# Altium schematic sheet 07_ZYNQ_DDR.SchDoc
size A3; SheetNumber: 7; SheetTotal: 9
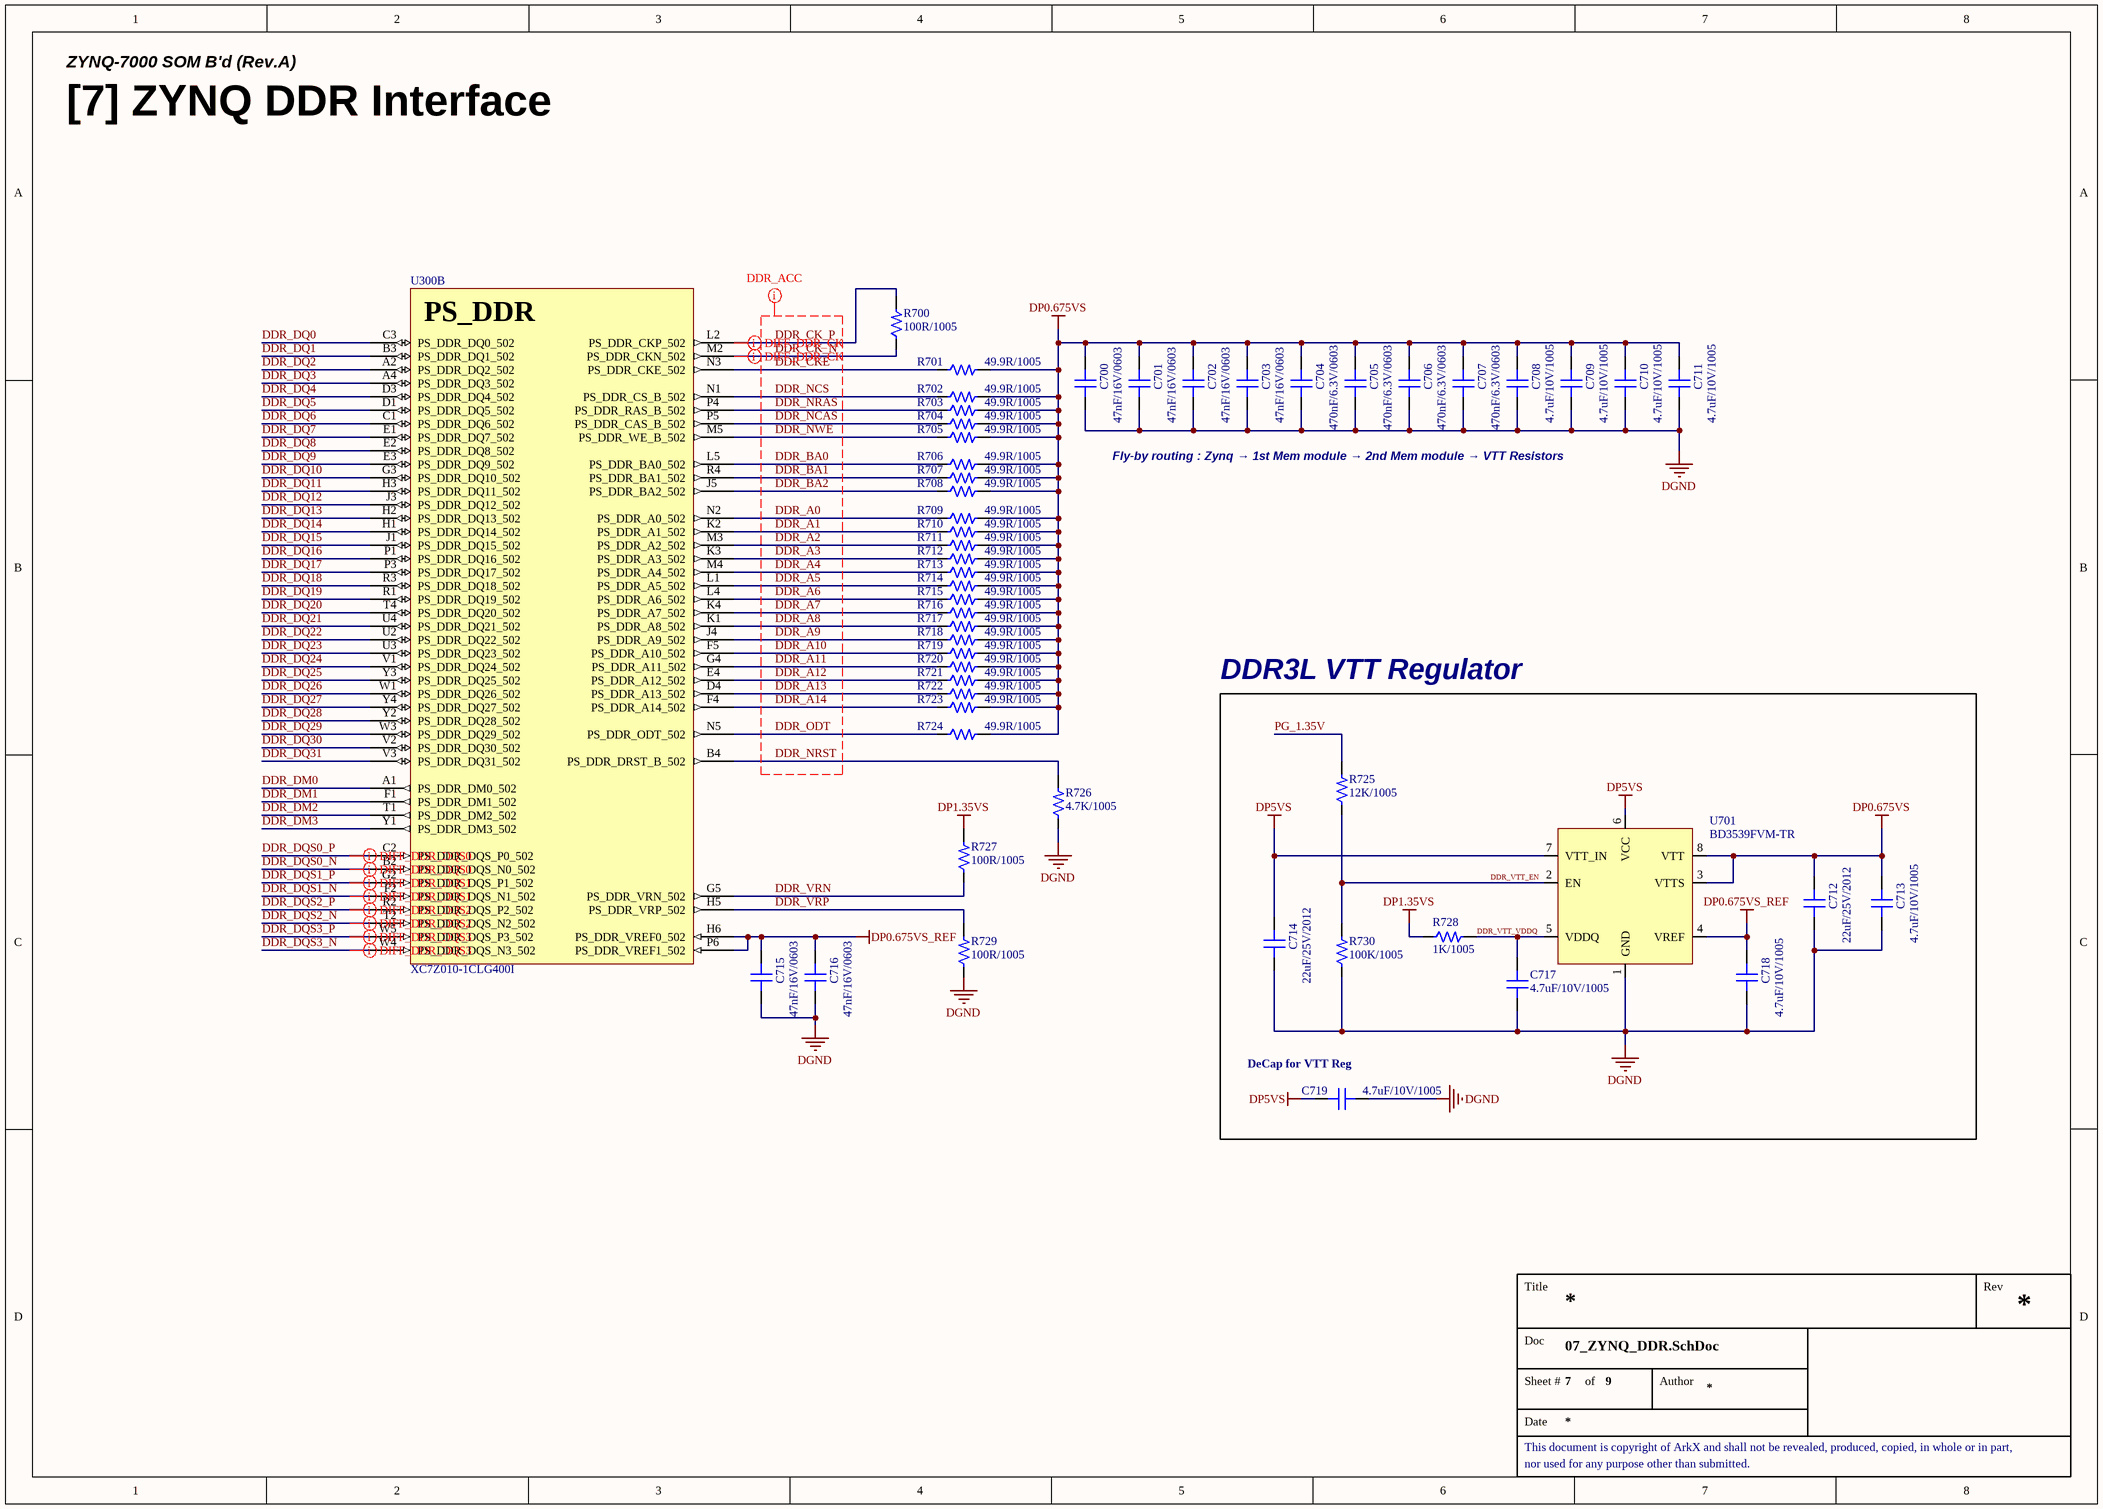
[diagram p0: 07_ZYNQ_DDR.SchDoc]

## Parts
C700  47nF/16V/0603  [CAP 0603 (0201_INCH)]
C701  47nF/16V/0603  [CAP 0603 (0201_INCH)]
C702  47nF/16V/0603  [CAP 0603 (0201_INCH)]
C703  47nF/16V/0603  [CAP 0603 (0201_INCH)]
C704  470nF/6.3V/0603  [CAP 0603 (0201_INCH)]
C705  470nF/6.3V/0603  [CAP 0603 (0201_INCH)]
C706  470nF/6.3V/0603  [CAP 0603 (0201_INCH)]
C707  470nF/6.3V/0603  [CAP 0603 (0201_INCH)]
C708  4.7uF/10V/1005  [CAP 1005 (0402_INCH)]
C709  4.7uF/10V/1005  [CAP 1005 (0402_INCH)]
C710  4.7uF/10V/1005  [CAP 1005 (0402_INCH)]
C711  4.7uF/10V/1005  [CAP 1005 (0402_INCH)]
C712  22uF/25V/2012  [CAP 2012 (0805_INCH)]
C713  4.7uF/10V/1005  [CAP 1005 (0402_INCH)]
C714  22uF/25V/2012  [CAP 2012 (0805_INCH)]
C715  47nF/16V/0603  [CAP 0603 (0201_INCH)]
C716  47nF/16V/0603  [CAP 0603 (0201_INCH)]
C717  4.7uF/10V/1005  [CAP 1005 (0402_INCH)]
C718  4.7uF/10V/1005  [CAP 1005 (0402_INCH)]
C719  4.7uF/10V/1005  [CAP 1005 (0402_INCH)]
R700  100R/1005  [RES 1005 (0402_inch)]
R701  49.9R/1005  [RES 1005 (0402_inch)]
R702  49.9R/1005  [RES 1005 (0402_inch)]
R703  49.9R/1005  [RES 1005 (0402_inch)]
R704  49.9R/1005  [RES 1005 (0402_inch)]
R705  49.9R/1005  [RES 1005 (0402_inch)]
R706  49.9R/1005  [RES 1005 (0402_inch)]
R707  49.9R/1005  [RES 1005 (0402_inch)]
R708  49.9R/1005  [RES 1005 (0402_inch)]
R709  49.9R/1005  [RES 1005 (0402_inch)]
R710  49.9R/1005  [RES 1005 (0402_inch)]
R711  49.9R/1005  [RES 1005 (0402_inch)]
R712  49.9R/1005  [RES 1005 (0402_inch)]
R713  49.9R/1005  [RES 1005 (0402_inch)]
R714  49.9R/1005  [RES 1005 (0402_inch)]
R715  49.9R/1005  [RES 1005 (0402_inch)]
R716  49.9R/1005  [RES 1005 (0402_inch)]
R717  49.9R/1005  [RES 1005 (0402_inch)]
R718  49.9R/1005  [RES 1005 (0402_inch)]
R719  49.9R/1005  [RES 1005 (0402_inch)]
R720  49.9R/1005  [RES 1005 (0402_inch)]
R721  49.9R/1005  [RES 1005 (0402_inch)]
R722  49.9R/1005  [RES 1005 (0402_inch)]
R723  49.9R/1005  [RES 1005 (0402_inch)]
R724  49.9R/1005  [RES 1005 (0402_inch)]
R725  12K/1005  [RES 1005 (0402_inch)]
R726  4.7K/1005  [RES 1005 (0402_inch)]
R727  100R/1005  [RES 1005 (0402_inch)]
R728  1K/1005  [RES 1005 (0402_inch)]
R729  100R/1005  [RES 1005 (0402_inch)]
R730  100K/1005  [RES 1005 (0402_inch)]
U300  XC7Z010-1CLG400I  [IC_SOC_XC7Z010-1CLG400I]  (part B of 9)
U701  BD3539FVM-TR  [IC_MSOP-8]

## Blocks framed on the sheet
DDR3L VTT Regulator: C712-C714 C717-C719 R725 R728 R730 U701

## Nets
DGND: C700.1 C701.1 C702.1 C703.1 C704.1 C705.1 C706.1 C707.1 C708.1 C709.1 C710.1 C711.1 C712.1 C713.1 C714.1 C715.1 C716.1 C717.1 C718.1 C719.2 R726.1 R729.1 R730.1 U701.1(GND)
DP0.675VS: C700.2 C701.2 C702.2 C703.2 C704.2 C705.2 C706.2 C707.2 C708.2 C709.2 C710.2 C711.2 C712.2 C713.2 R701.2 R702.2 R703.2 R704.2 R705.2 R706.2 R707.2 R708.2 R709.2 R710.2 R711.2 R712.2 R713.2 R714.2 R715.2 R716.2 R717.2 R718.2 R719.2 R720.2 R721.2 R722.2 R723.2 R724.2 U701.3(VTTS) U701.8(VTT)
DP0.675VS_REF: C715.2 C716.2 C718.2 U300.H6(PS_DDR_VREF0_502) U300.P6(PS_DDR_VREF1_502) U701.4(VREF)
DP1.35VS: R727.2 R728.1
DP5VS: C714.2 C719.1 U701.6(VCC) U701.7(VTT_IN)
DDR_A0: R709.1 U300.N2(PS_DDR_A0_502)
DDR_A1: R710.1 U300.K2(PS_DDR_A1_502)
DDR_A2: R711.1 U300.M3(PS_DDR_A2_502)
DDR_A3: R712.1 U300.K3(PS_DDR_A3_502)
DDR_A4: R713.1 U300.M4(PS_DDR_A4_502)
DDR_A5: R714.1 U300.L1(PS_DDR_A5_502)
DDR_A6: R715.1 U300.L4(PS_DDR_A6_502)
DDR_A7: R716.1 U300.K4(PS_DDR_A7_502)
DDR_A8: R717.1 U300.K1(PS_DDR_A8_502)
DDR_A9: R718.1 U300.J4(PS_DDR_A9_502)
DDR_A10: R719.1 U300.F5(PS_DDR_A10_502)
DDR_A11: R720.1 U300.G4(PS_DDR_A11_502)
DDR_A12: R721.1 U300.E4(PS_DDR_A12_502)
DDR_A13: R722.1 U300.D4(PS_DDR_A13_502)
DDR_A14: R723.1 U300.F4(PS_DDR_A14_502)
DDR_BA0: R706.1 U300.L5(PS_DDR_BA0_502)
DDR_BA1: R707.1 U300.R4(PS_DDR_BA1_502)
DDR_BA2: R708.1 U300.J5(PS_DDR_BA2_502)
DDR_CK_N: R700.1 U300.M2(PS_DDR_CKN_502)
DDR_CK_P: R700.2 U300.L2(PS_DDR_CKP_502)
DDR_CKE: R701.1 U300.N3(PS_DDR_CKE_502)
DDR_DM0: U300.A1(PS_DDR_DM0_502)
DDR_DM1: U300.F1(PS_DDR_DM1_502)
DDR_DM2: U300.T1(PS_DDR_DM2_502)
DDR_DM3: U300.Y1(PS_DDR_DM3_502)
DDR_DQ0: U300.C3(PS_DDR_DQ0_502)
DDR_DQ1: U300.B3(PS_DDR_DQ1_502)
DDR_DQ2: U300.A2(PS_DDR_DQ2_502)
DDR_DQ3: U300.A4(PS_DDR_DQ3_502)
DDR_DQ4: U300.D3(PS_DDR_DQ4_502)
DDR_DQ5: U300.D1(PS_DDR_DQ5_502)
DDR_DQ6: U300.C1(PS_DDR_DQ6_502)
DDR_DQ7: U300.E1(PS_DDR_DQ7_502)
DDR_DQ8: U300.E2(PS_DDR_DQ8_502)
DDR_DQ9: U300.E3(PS_DDR_DQ9_502)
DDR_DQ10: U300.G3(PS_DDR_DQ10_502)
DDR_DQ11: U300.H3(PS_DDR_DQ11_502)
DDR_DQ12: U300.J3(PS_DDR_DQ12_502)
DDR_DQ13: U300.H2(PS_DDR_DQ13_502)
DDR_DQ14: U300.H1(PS_DDR_DQ14_502)
DDR_DQ15: U300.J1(PS_DDR_DQ15_502)
DDR_DQ16: U300.P1(PS_DDR_DQ16_502)
DDR_DQ17: U300.P3(PS_DDR_DQ17_502)
DDR_DQ18: U300.R3(PS_DDR_DQ18_502)
DDR_DQ19: U300.R1(PS_DDR_DQ19_502)
DDR_DQ20: U300.T4(PS_DDR_DQ20_502)
DDR_DQ21: U300.U4(PS_DDR_DQ21_502)
DDR_DQ22: U300.U2(PS_DDR_DQ22_502)
DDR_DQ23: U300.U3(PS_DDR_DQ23_502)
DDR_DQ24: U300.V1(PS_DDR_DQ24_502)
DDR_DQ25: U300.Y3(PS_DDR_DQ25_502)
DDR_DQ26: U300.W1(PS_DDR_DQ26_502)
DDR_DQ27: U300.Y4(PS_DDR_DQ27_502)
DDR_DQ28: U300.Y2(PS_DDR_DQ28_502)
DDR_DQ29: U300.W3(PS_DDR_DQ29_502)
DDR_DQ30: U300.V2(PS_DDR_DQ30_502)
DDR_DQ31: U300.V3(PS_DDR_DQ31_502)
DDR_DQS0_N: U300.B2(PS_DDR_DQS_N0_502)
DDR_DQS0_P: U300.C2(PS_DDR_DQS_P0_502)
DDR_DQS1_N: U300.F2(PS_DDR_DQS_N1_502)
DDR_DQS1_P: U300.G2(PS_DDR_DQS_P1_502)
DDR_DQS2_N: U300.T2(PS_DDR_DQS_N2_502)
DDR_DQS2_P: U300.R2(PS_DDR_DQS_P2_502)
DDR_DQS3_N: U300.W4(PS_DDR_DQS_N3_502)
DDR_DQS3_P: U300.W5(PS_DDR_DQS_P3_502)
DDR_NCAS: R704.1 U300.P5(PS_DDR_CAS_B_502)
DDR_NCS: R702.1 U300.N1(PS_DDR_CS_B_502)
DDR_NRAS: R703.1 U300.P4(PS_DDR_RAS_B_502)
DDR_NRST: R726.2 U300.B4(PS_DDR_DRST_B_502)
DDR_NWE: R705.1 U300.M5(PS_DDR_WE_B_502)
DDR_ODT: R724.1 U300.N5(PS_DDR_ODT_502)
DDR_VRN: R727.1 U300.G5(PS_DDR_VRN_502)
DDR_VRP: R729.2 U300.H5(PS_DDR_VRP_502)
DDR_VTT_EN: R725.1 R730.2 U701.2(EN)
DDR_VTT_VDDQ: C717.2 R728.2 U701.5(VDDQ)
PG_1.35V: R725.2

## Layout directives
net class DDR_ACC; rule Matched Net Lengths [Delay Tolerance = 10ps]: DDR_A0, DDR_A1, DDR_A2, DDR_A3, DDR_A4, DDR_A5, DDR_A6, DDR_A7, DDR_A8, DDR_A9, DDR_A10, DDR_A11, DDR_A12, DDR_A13, DDR_A14, DDR_BA0, DDR_BA1, DDR_BA2, DDR_CK_N, DDR_CK_P, DDR_CKE, DDR_NCAS, DDR_NCS, DDR_NRAS, DDR_NRST, DDR_NWE, DDR_ODT
differential pair; differential pair class DIFF_DDR_CK: DDR_CK_N, DDR_CK_P
differential pair; differential pair class DIFF_DDR_DQS0: DDR_DQS0_N, DDR_DQS0_P
differential pair; differential pair class DIFF_DDR_DQS1: DDR_DQS1_N, DDR_DQS1_P
differential pair; differential pair class DIFF_DDR_DQS2: DDR_DQS2_N, DDR_DQS2_P
differential pair; differential pair class DIFF_DDR_DQS3: DDR_DQS3_N, DDR_DQS3_P

## Notes on the sheet
- ZYNQ-7000 SOM B'd (Rev.A)
- [7] ZYNQ DDR Interface
- Fly-by routing : Zynq → 1st Mem module → 2nd Mem module → VTT Resistors
- (near C719) DeCap for VTT Reg
- Title
- Rev
- Doc
- Sheet #
- of
- Author
- This document is copyright of ArkX and shall not be revealed, produced, copied, in whole or in part,
- Date
- nor used for any purpose other than submitted.
- (in symbol IC_SOC_XC7Z010-1CLG400I, part B) PS_DDR

## Library data of the parts
C700-C703 C715 C716 = CAP_47nF/16V/0603: 16V 47nF X5R ±10% 0201 Multilayer Ceramic Capacitors MLCC - SMD/SMT ROHS; JLCPCB Part Type: Extended Part; LCSC Part #: C88917
C704-C707 = CAP_470nF/6.3V/0603: 6.3V 470nF X5R ±10% 0201  Multilayer Ceramic Capacitors MLCC - SMD/SMT ROHS; JLCPCB Part Type: Extended Part; LCSC Part #: C85926
C708-C711 C713 C717-C719 = CAP_4.7uF/10V/1005: 10V 4.7uF X5R ±20% 0402  Multilayer Ceramic Capacitors MLCC - SMD/SMT ROHS; JLCPCB Part Type: Basic Part; LCSC Part #: C23733
C712 C714 = CAP_22uF/25V/2012: Ceramic CAP_22uF/25V/2012; LCSC Part #: C45783; JLCPCB Part Type: Basic Part
R700 R727 R729 = RES_100R/1005/62.5mW: Value: 100R; Power Rating: 62.5mW; Precision: 1%; Size: 1005; LCSC Part #: C25076; JLCPCB Part Type: Basic Part
R701-R724 = RES_49.9R/1005/62.5mW: Value: 49.9R; Power Rating: 62.5mW; Precision: 1%; Size: 1005; LCSC Part #: C25120; JLCPCB Part Type: Basic Part
R725 = RES_12K/1005/62.5mW: Value: 12K; Power Rating: 62.5mW; Precision: 1%; Size: 1005; LCSC Part #: C25752; JLCPCB Part Type: Basic Part
R726 = RES_4.7K/1005/62.5mW: Value: 4.7K; Power Rating: 62.5mW; Precision: 1%; Size: 1005; LCSC Part #: C25900; JLCPCB Part Type: Basic Part
R728 = RES_1K/1005/62.5mW: Value: 1K; Power Rating: 62.5mW; Precision: 1%; Size: 1005; LCSC Part #: C11702; JLCPCB Part Type: Basic Part
R730 = RES_100K/1005/62.5mW: Value: 100K; Power Rating: 62.5mW; Precision: 1%; Size: 1005; LCSC Part #: C25741; JLCPCB Part Type: Basic Part
U300 = IC_SOC_XC7Z010-1CLG400I: Dual ARM® Cortex®-A9 MPCore™ with CoreSight™ System On Chip (SOC) IC Zynq®-7000 Artix™-7 FPGA, 28K Logic Cells 766MHz 400-CSPBGA (17x17); LCSC Part #: C2840994; JLCPCB Part Type: Extended Part
U701 = IC_REG_VTT_BD3539FVM-TR: 1.0V to 5.5V, 1A 1ch / Termination Regulators for DDR-SDRAMs, 8-MSOP; LCSC Part #: C213437; JLCPCB Part Type: Extended Part